# EAGLE schematic beltpack_v1_fixed (EAGLE 6.6.0)
Assembly variants: Cascade

## Sheet 1 of 5
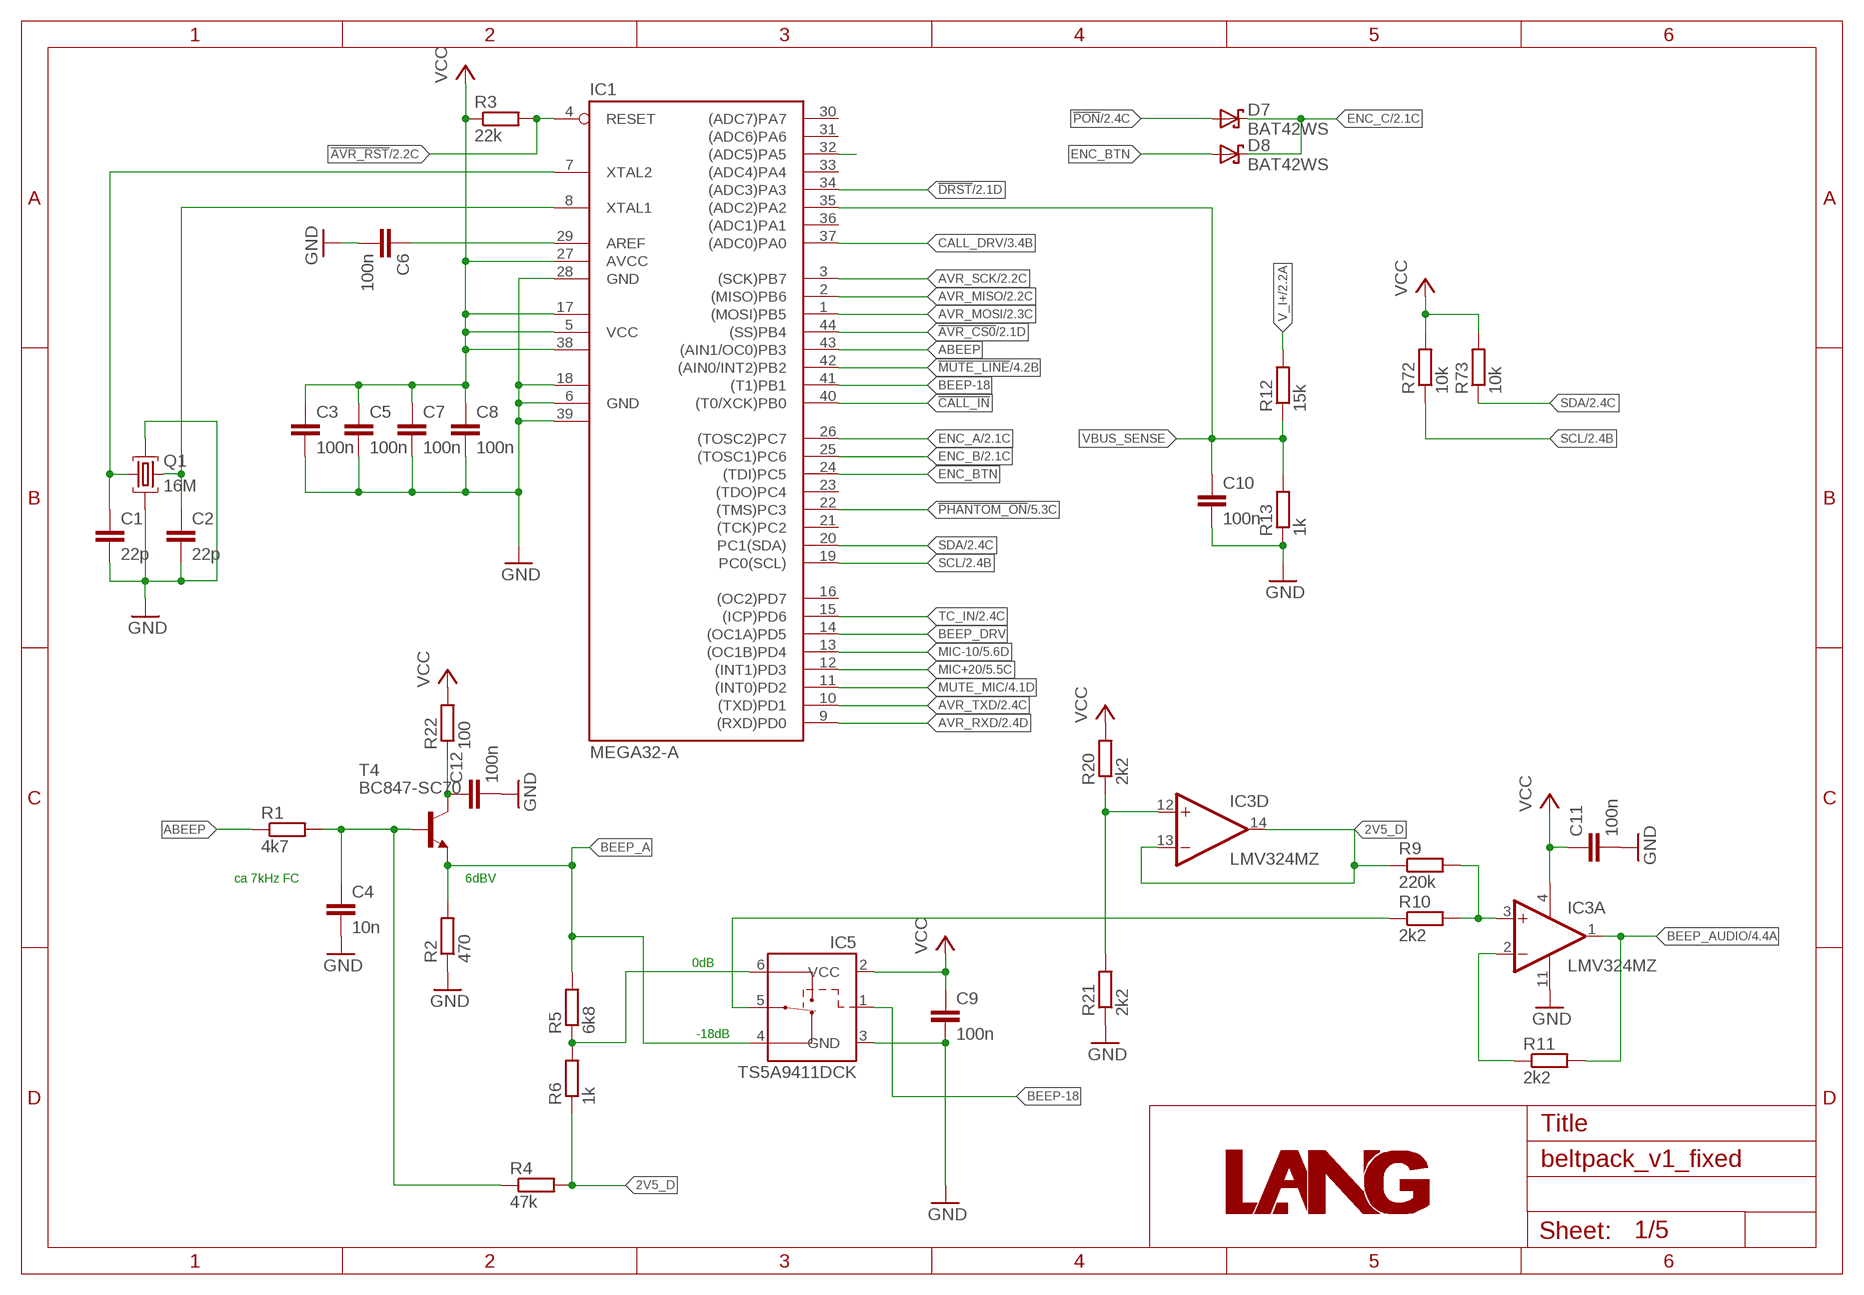
[diagram p0: schematic, sheet 1]
FRAME1 (A4L-LOC): PAGE_TITLE: Title

### Parts
C1  22p  C-EUC0603  [C0603]
C2  22p  C-EUC0603  [C0603]
C3  100n  C-EUC0603  [C0603]
C4  10n  C-EUC0603  [C0603]
C5  100n  C-EUC0603  [C0603]
C6  100n  C-EUC0603  [C0603]
C7  100n  C-EUC0603  [C0603]
C8  100n  C-EUC0603  [C0603]
C9  100n  C-EUC0603  [C0603]
C10  100n  C-EUC0603  [C0603]
C11  100n  C-EUC0603  [C0603]
C12  100n  C-EUC0603  [C0603]
D7  BAT42WS  [SOD323R_INFINEON]
D8  BAT42WS  [SOD323R_INFINEON]
IC1  MEGA32-A  [TQFP44]
IC3  LMV324MZ  [TSSOP14]
IC5  TS5A9411DCK  [SC70-6L]
Q1  16M  CRYSTAL_SHIELDEDMT  [MT]
R1  4k7  R-EU_R0603  [R0603]
R2  470  R-EU_R0603  [R0603]
R3  22k  R-EU_R0603  [R0603]
R4  47k  R-EU_R0603  [R0603]
R5  6k8  R-EU_R0603  [R0603]
R6  1k  R-EU_R0603  [R0603]
R9  220k  R-EU_R0603  [R0603]
R10  2k2  R-EU_R0603  [R0603]
R11  2k2  R-EU_R0603  [R0603]
R12  15k  R-EU_R0603  [R0603]
R13  1k  R-EU_R0603  [R0603]
R20  2k2  R-EU_R0603  [R0603]
R21  2k2  R-EU_R0603  [R0603]
R22  100  R-EU_R0603  [R0603]
R72  10k  R-EU_R0603  [R0603]
R73  10k  R-EU_R0603  [R0603]
T4  BC847-SC70  [SC70]

### Nets
2V5_D: IC3.13(D:-IN) IC3.14(D:OUT) R4.2 R6.1 R9.1
!AVR_CS0!: IC1.44((SS)PB4) ; also sheet 2
!AVR_RST!: IC1.4(RESET) R3.2 ; also sheet 2
!CALL_IN!: IC1.40((T0/XCK)PB0) ; also sheet 2
!DRST!: IC1.34((ADC3)PA3) ; also sheet 2
!MUTE_LINE!: IC1.42((AIN0/INT2)PB2) ; also sheet 4
!PHANTOM_ON!: IC1.22((TMS)PC3) ; also sheet 5
!PON!: D7.A ; also sheet 2
+5VA: C12.1 R22.1 T4.3(C)
ABEEP: IC1.43((AIN1/OC0)PB3) R1.1
AVR_MISO: IC1.2((MISO)PB6) ; also sheet 2
AVR_MOSI: IC1.1((MOSI)PB5) ; also sheet 2
AVR_RXD: IC1.9((RXD)PD0) ; also sheet 2
AVR_SCK: IC1.3((SCK)PB7) ; also sheet 2
AVR_TXD: IC1.10((TXD)PD1) ; also sheet 2
BEEP-18: IC1.41((T1)PB1) IC5.1(CTL)
BEEP_A: IC5.4(NC) R2.2 R5.2 T4.2(E)
BEEP_AUDIO: IC3.1(A:OUT) R11.2 ; also sheet 4
BEEP_DRV: IC1.14((OC1A)PD5)
CALL_DRV: IC1.37((ADC0)PA0) ; also sheet 3
ENC_A: IC1.26((TOSC2)PC7) ; also sheet 2
ENC_B: IC1.25((TOSC1)PC6) ; also sheet 2
ENC_BTN: D8.A IC1.24((TDI)PC5)
ENC_C: D7.C(K) D8.C(K) ; also sheet 2
GND: C1.2 C2.2 C3.2 C4.2 C5.2 C6.2 C7.2 C8.2 C9.2 C10.2 C11.2 C12.2 IC1.6(GND) IC1.18(GND1) IC1.28(GND) IC1.39(GND2) IC3.11(P:V-) IC5.3(GND) Q1.2(G1) Q1.4(G2) R2.1 R13.1 R21.1 ; also sheet 2,3,4,5
MIC+20: IC1.12((INT1)PD3) ; also sheet 5
MIC-10: IC1.13((OC1B)PD4) ; also sheet 5
MUTE_MIC: IC1.11((INT0)PD2) ; also sheet 4
N$17: C4.1 R1.2 R4.1 T4.1(B)
N$28: IC5.6(NO) R5.1 R6.2
N$39: IC3.12(D:+IN) R20.1 R21.2
N$52: IC3.3(A:+IN) R9.2 R10.2
N$53: IC3.2(A:-IN) R11.1
N$54: IC5.5(COM) R10.1
N$55: C6.1 IC1.29(AREF)
N$59: C1.1 IC1.7(XTAL2) Q1.1
N$60: C2.1 IC1.8(XTAL1) Q1.3
N$87: IC1.32((ADC5)PA5)
SCL: IC1.19(PC0(SCL)) R72.1 ; also sheet 2,4
SDA: IC1.20(PC1(SDA)) R73.1 ; also sheet 2,4
TC_IN: IC1.15((ICP)PD6) ; also sheet 2
V_I+: R12.2 ; also sheet 2
VBUS_SENSE: C10.1 IC1.35((ADC2)PA2) R12.1 R13.2
VCC: C3.1 C5.1 C7.1 C8.1 C9.1 C11.1 IC1.5(VCC) IC1.17(VCC1) IC1.27(AVCC) IC1.38(VCC2) IC3.4(P:V+) IC5.2(VCC) R3.1 R20.2 R22.2 R72.2 R73.2 ; also sheet 2,4,5
Unconnected: IC1.16((OC2)PD7) IC1.21((TCK)PC2) IC1.23((TDO)PC4) IC1.30((ADC7)PA7) IC1.31((ADC6)PA6) IC1.33((ADC4)PA4) IC1.36((ADC1)PA1)

### Notes on the sheet
- ca 7kHz FC | 6dBV
- 0dB
- -18dB

## Sheet 2 of 5
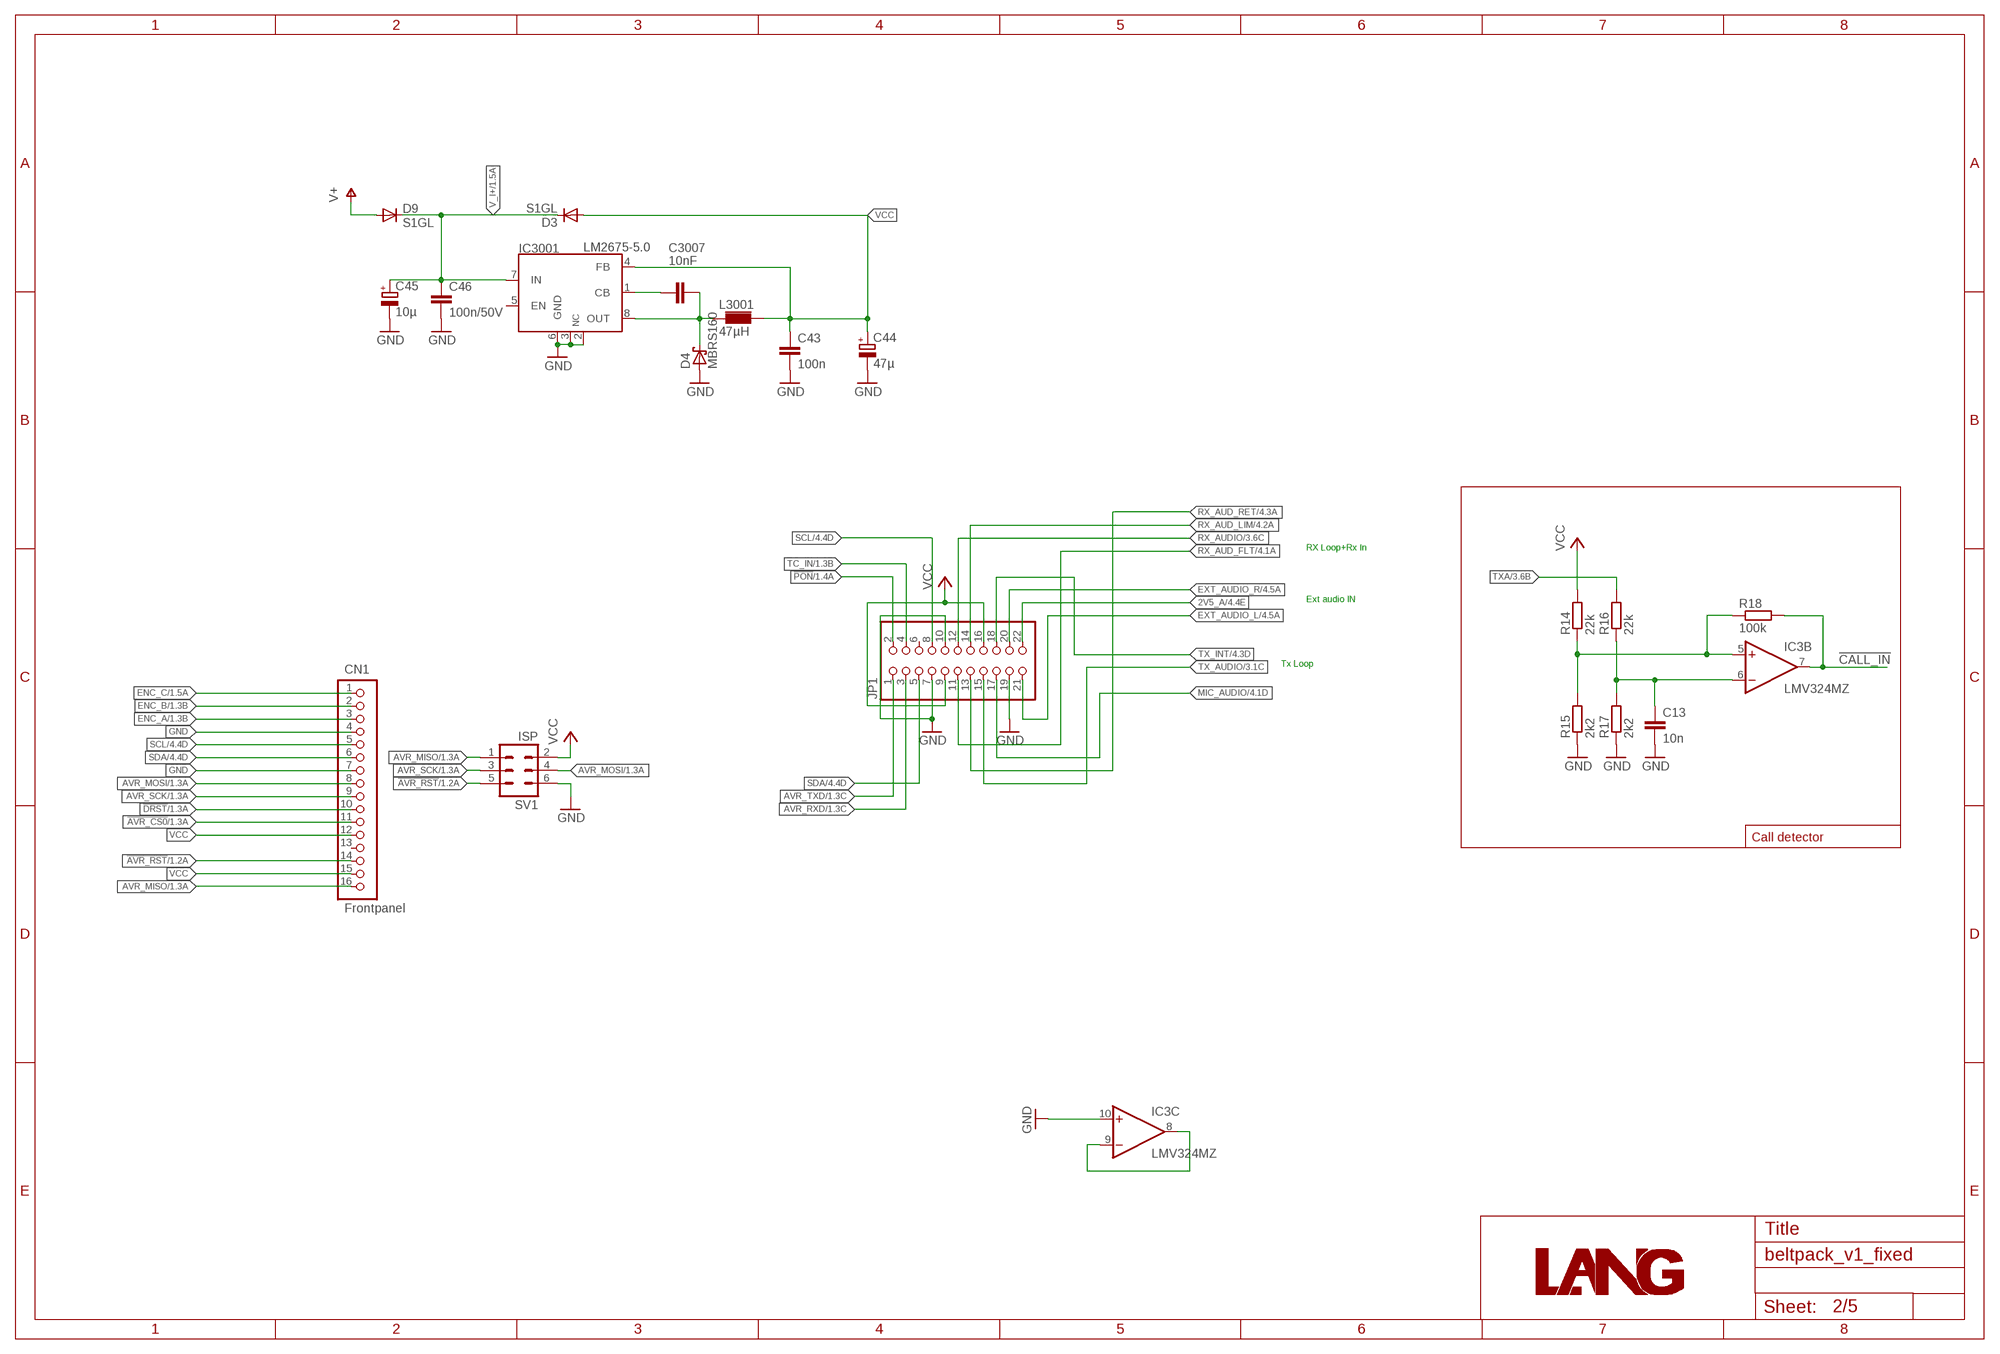
[diagram p1: schematic, sheet 2]
FRAME5 (A3L-LOC): PAGE_TITLE: Title

### Parts
C13  10n  C-EUC0603  [C0603]
C43  100n  C-EUC0603  [C0603]
C44  47µ  CPOL-EUB  [PANASONIC_B]
C45  10µ  CPOL-EUC  [PANASONIC_C]
C46  100n/50V  C-EUC0805  [C0805]
C3007  10nF  C-EUC0805  [C0805]
CN1  Frontpanel  MOLEX-505278-1633  [MOLEX-505278-1633]
D3  S1GL  DIODE-DO219AB  [DO219AB]
D4  MBRS160  SCHOTTKY-DIODESMD  [SMB]
D9  S1GL  DIODE-DO219AB  [DO219AB]
IC3001  LM2675-5.0  LM2676_SOIC  [SO-08]
JP1  PINHD-2X11  [2X11]
L3001  47µH  L-PISM  [PISM]
R14  22k  R-EU_R0603  [R0603]
R15  2k2  R-EU_R0603  [R0603]
R16  22k  R-EU_R0603  [R0603]
R17  2k2  R-EU_R0603  [R0603]
R18  100k  R-EU_R0603  [R0603]
SV1  ISP  ML6  [ML6]

### Nets
2V5_A: JP1.22 ; also sheet 4,5
!AVR_CS0!: CN1.11 ; also sheet 1
!AVR_RST!: CN1.14 SV1.5 ; also sheet 1
!CALL_IN!: IC3.7(B:OUT) R18.2 ; also sheet 1
!DRST!: CN1.10 ; also sheet 1
!PON!: JP1.2 ; also sheet 1
AVR_MISO: CN1.16 SV1.1 ; also sheet 1
AVR_MOSI: CN1.8 SV1.4 ; also sheet 1
AVR_RXD: JP1.3 ; also sheet 1
AVR_SCK: CN1.9 SV1.3 ; also sheet 1
AVR_TXD: JP1.1 ; also sheet 1
ENC_A: CN1.3 ; also sheet 1
ENC_B: CN1.2 ; also sheet 1
ENC_C: CN1.1 ; also sheet 1
EXT_AUDIO_L: JP1.21 ; also sheet 4
EXT_AUDIO_R: JP1.20 ; also sheet 4
GND: C13.2 C43.2 C44.- C45.- C46.2 CN1.4 CN1.7 D4.A IC3.10(C:+IN) IC3001.2(NC) IC3001.3(NC) IC3001.6(GND) JP1.7 JP1.10 JP1.19 R15.1 R17.1 SV1.6 ; also sheet 1,3,4,5
MIC_AUDIO: JP1.17 ; also sheet 4,5
N$27: C3007.2 D4.C IC3001.8(OUT) L3001.P$1
N$29: C3007.1 IC3001.1(CB)
N$41: IC3.8(C:OUT) IC3.9(C:-IN)
N$50: C13.1 IC3.6(B:-IN) R16.1 R17.2
N$51: IC3.5(B:+IN) R14.1 R15.2 R18.1
RX_AUD_FLT: JP1.11 ; also sheet 4
RX_AUD_LIM: JP1.14 ; also sheet 4
RX_AUD_RET: JP1.13 ; also sheet 4
RX_AUDIO: JP1.12 ; also sheet 3,4
SCL: CN1.5 JP1.8 ; also sheet 1,4
SDA: CN1.6 JP1.5 ; also sheet 1,4
TC_IN: JP1.4 ; also sheet 1
TX_AUDIO: JP1.15 ; also sheet 3,4
TX_INT: JP1.18 ; also sheet 4
TXA: R16.2 ; also sheet 3
V+: D9.A ; also sheet 3
V_I+: C45.+ C46.1 D3.C D9.C IC3001.7(IN) ; also sheet 1
VCC: C43.1 C44.+ CN1.12 CN1.15 D3.A IC3001.4(FB) JP1.9 JP1.16 L3001.P$2 R14.2 SV1.2 ; also sheet 1,4,5
Unconnected: CN1.13 IC3001.5(EN) JP1.6

### Notes on the sheet
- RX Loop+Rx In
- Ext audio IN
- Tx Loop
- Call detector

## Sheet 3 of 5
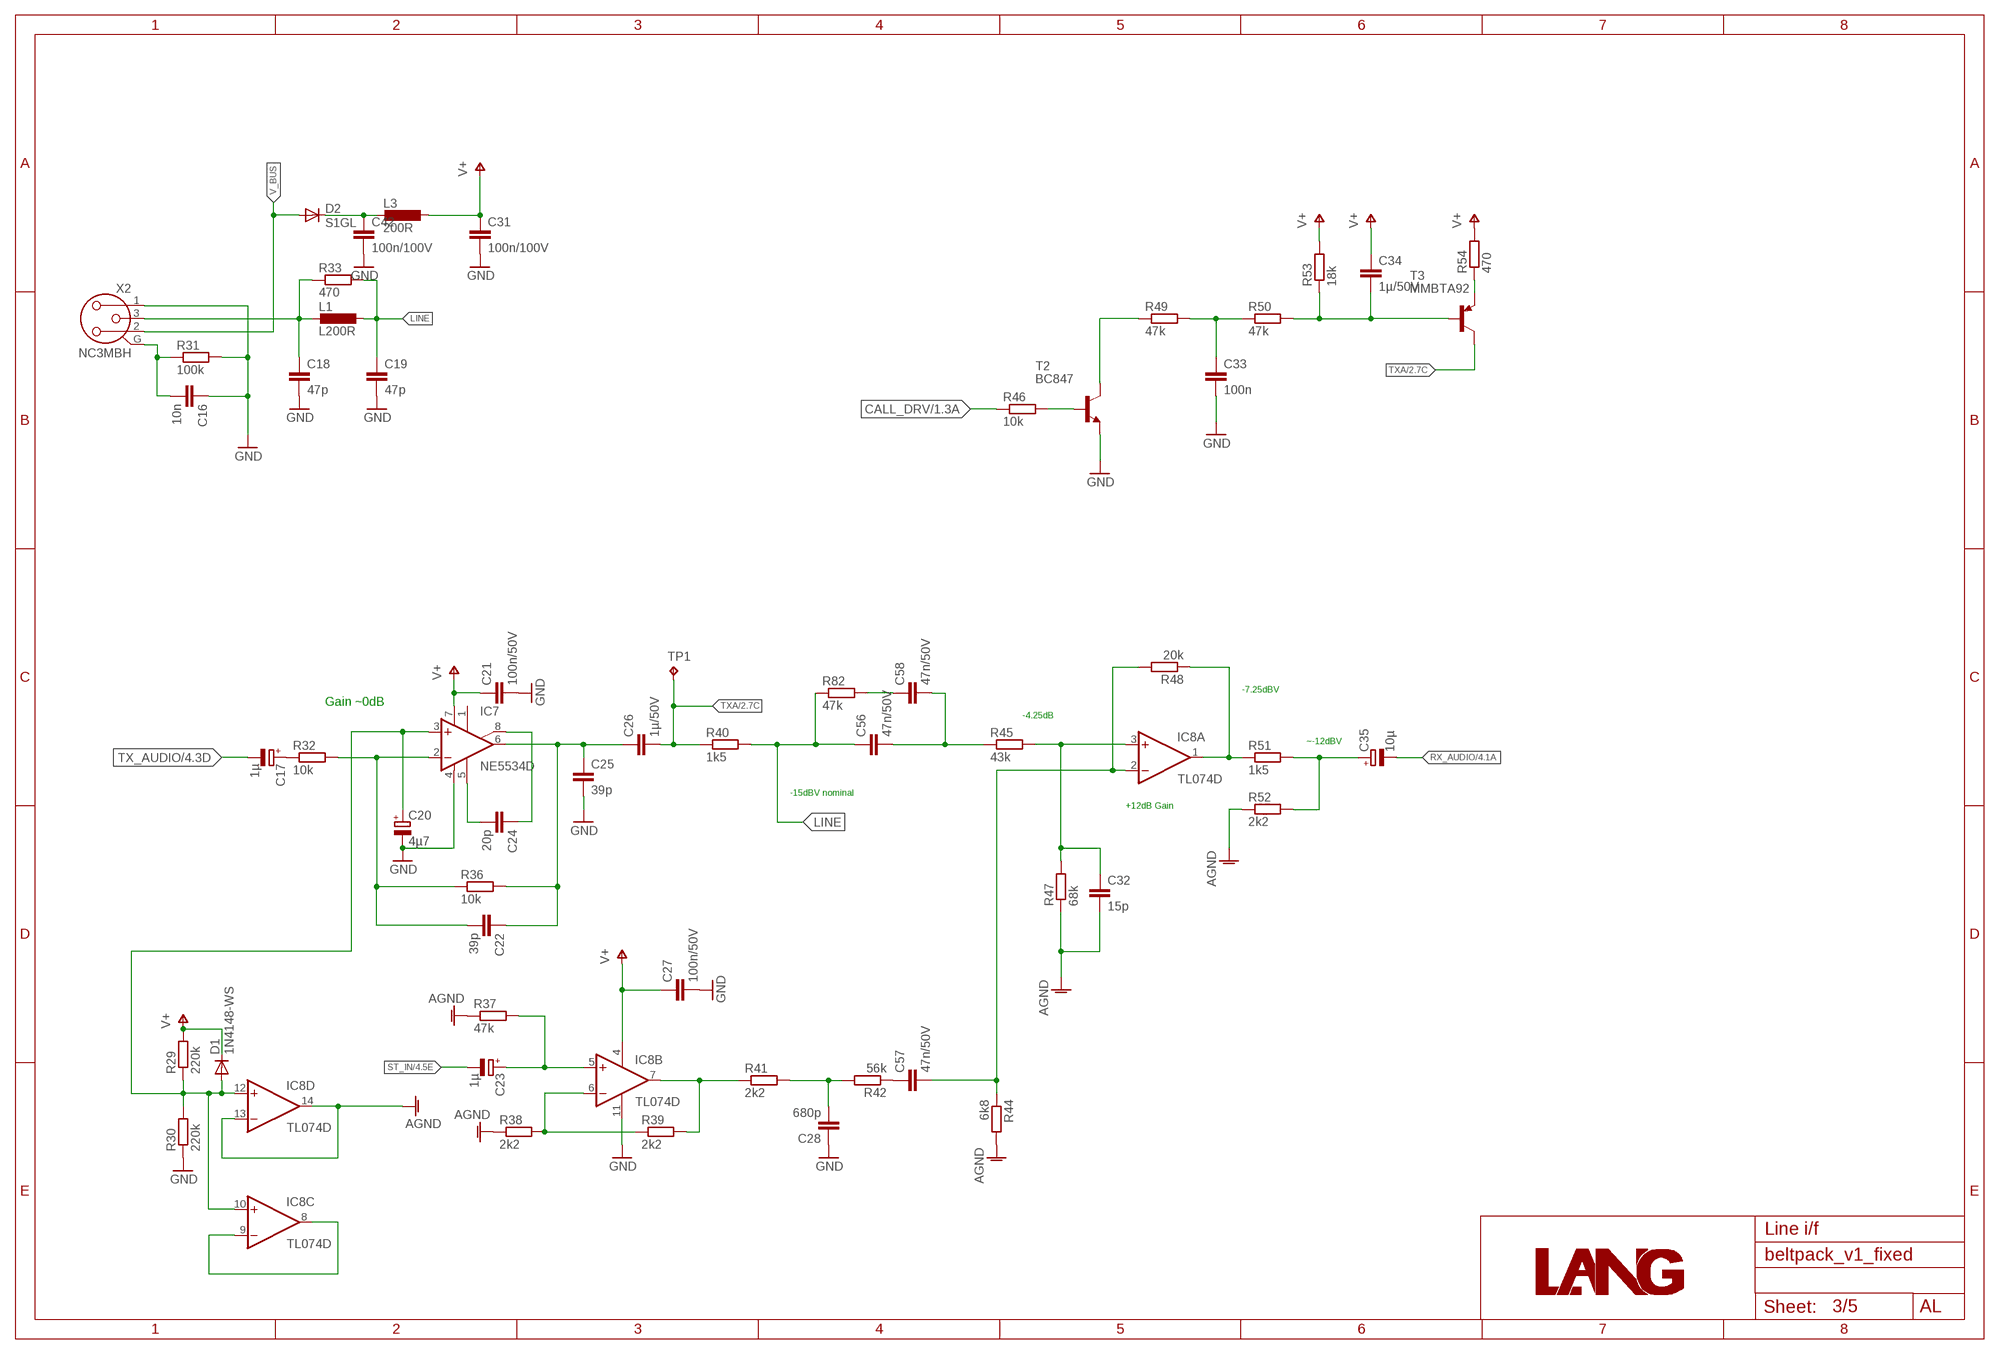
[diagram p2: schematic, sheet 3]
FRAME2 (A3L-LOC): EDITOR_INITIALS: AL; PAGE_TITLE: Line i/f

### Parts
C16  10n  C-EUC0805  [C0805]
C17  1µ  CPOL-EUB  [PANASONIC_B]
C18  47p  C-EUC0603  [C0603]
C19  47p  C-EUC0603  [C0603]
C20  4µ7  CPOL-EUB  [PANASONIC_B]
C21  100n/50V  C-EUC0805  [C0805]
C22  39p  C-EUC0603  [C0603]
C23  1µ  CPOL-EUB  [PANASONIC_B]
C24  20p  C-EUC0603  [C0603]
C25  39p  C-EUC0603  [C0603]
C26  1µ/50V  C-EUC1206  [C1206]
C27  100n/50V  C-EUC0805  [C0805]
C28  680p  C-EUC0603  [C0603]
C31  100n/100V  C-EUC1206  [C1206]
C32  15p  C-EUC0603  [C0603]
C33  100n  C-EUC0603  [C0603]
C34  1µ/50V  C-EUC1206  [C1206]
C35  10µ  CPOL-EUB  [PANASONIC_B]
C42  100n/100V  C-EUC1206  [C1206]
C56  47n/50V  C-EUPAN_E1  [C_PAN_ECHU_E1]
C57  47n/50V  C-EUPAN_E1  [C_PAN_ECHU_E1]
C58  47n/50V  C-EUPAN_E1  [C_PAN_ECHU_E1]
D1  1N4148-WS  [SOD323]
D2  S1GL  DIODE-DO219AB  [DO219AB]
IC7  NE5534D  [SO08]
IC8  TL074D  [SO14]
L1  L200R  L-EU_L0805  [R0805]
L3  200R  L-EU_L0805  [R0805]
R29  220k  R-EU_R0603  [R0603]
R30  220k  R-EU_R0603  [R0603]
R31  100k  R-EU_R0805  [R0805]
R32  10k  R-EU_R0603  [R0603]
R33  470  R-EU_R0603  [R0603]
R36  10k  R-EU_R0603  [R0603]
R37  47k  R-EU_R0603  [R0603]
R38  2k2  R-EU_R0603  [R0603]
R39  2k2  R-EU_R0603  [R0603]
R40  1k5  R-EU_R1206  [R1206]
R41  2k2  R-EU_R0603  [R0603]
R42  56k  R-EU_R0603  [R0603]
R44  6k8  R-EU_R0603  [R0603]
R45  43k  R-EU_R0603  [R0603]
R46  10k  R-EU_R0603  [R0603]
R47  68k  R-EU_R0603  [R0603]
R48  20k  R-EU_R0603  [R0603]
R49  47k  R-EU_R0603  [R0603]
R50  47k  R-EU_R0603  [R0603]
R51  1k5  R-EU_R0603  [R0603]
R52  2k2  R-EU_R0603  [R0603]
R53  18k  R-EU_R0603  [R0603]
R54  470  R-EU_R0805  [R0805]
R82  47k  R-EU_R0603  [R0603]
T2  BC847  [SOT23]
T3  MMBTA92  [SOT23]
TP1  XA  TPB1,27  [B1,27]
X2  NC3MBH  [NC3MBH]

### Nets
AGND: C32.2 IC8.13(D:-IN) IC8.14(D:OUT) R37.1 R38.1 R44.2 R47.1 R52.1
CALL_DRV: R46.1 ; also sheet 1
GND: C16.1 C18.2 C19.2 C20.- C21.2 C25.2 C27.2 C28.1 C31.2 C33.2 C42.2 IC7.4(V-) IC8.11(P:V-) R30.1 R31.2 T2.2(E) X2.1 ; also sheet 1,2,4,5
LINE: C19.1 C56.1 L1.1 R33.2 R40.2 R82.1
N$1: C24.2 IC7.5(CMP)
N$2: C24.1 IC7.8(ON/CMP)
N$3: C22.2 IC7.2(-IN) R32.2 R36.1
N$4: C17.+ R32.1
N$5: C22.1 C25.1 C26.1 IC7.6(OUT) R36.2
N$6: C20.+ D1.A IC7.3(+IN) IC8.10(C:+IN) IC8.12(D:+IN) R29.1 R30.2
N$7: R46.2 T2.1(B)
N$8: C16.2 R31.1 X2.G
N$10: C58.1 R82.2
N$11: C28.2 R41.2 R42.2
N$12: C32.1 IC8.3(A:+IN) R45.2 R47.2
N$13: C18.1 L1.2 R33.1 X2.3
N$14: C35.+ R51.2 R52.2
N$15: C57.2 IC8.2(A:-IN) R44.1 R48.2
N$16: C57.1 R42.1
N$26: C42.1 D2.C L3.2
N$31: C56.2 C58.2 R45.1
N$32: R54.1 T3.2(E)
N$33: C34.2 R50.2 R53.1 T3.1(B)
N$34: C33.1 R49.2 R50.1
N$37: R49.1 T2.3(C)
N$42: IC8.1(A:OUT) R48.1 R51.1
N$66: IC8.7(B:OUT) R39.2 R41.1
N$70: IC8.6(B:-IN) R38.2 R39.1
N$76: C23.+ IC8.5(B:+IN) R37.2
N$77: IC8.8(C:OUT) IC8.9(C:-IN)
RX_AUDIO: C35.- ; also sheet 2,4
ST_IN: C23.- ; also sheet 4
TX_AUDIO: C17.- ; also sheet 2,4
TXA: C26.2 R40.1 T3.3(C) TP1.TP ; also sheet 2
V+: C21.1 C27.1 C31.1 C34.1 D1.K(C) IC7.7(V+) IC8.4(P:V+) L3.1 R29.2 R53.2 R54.2 ; also sheet 2
V_BUS: D2.A X2.2
Unconnected: IC7.1(ON)

### Notes on the sheet
- -7.25dBV
- Gain ~0dB
- -4.25dB
- ~-12dBV
- -15dBV nominal
- +12dB Gain

## Sheet 4 of 5
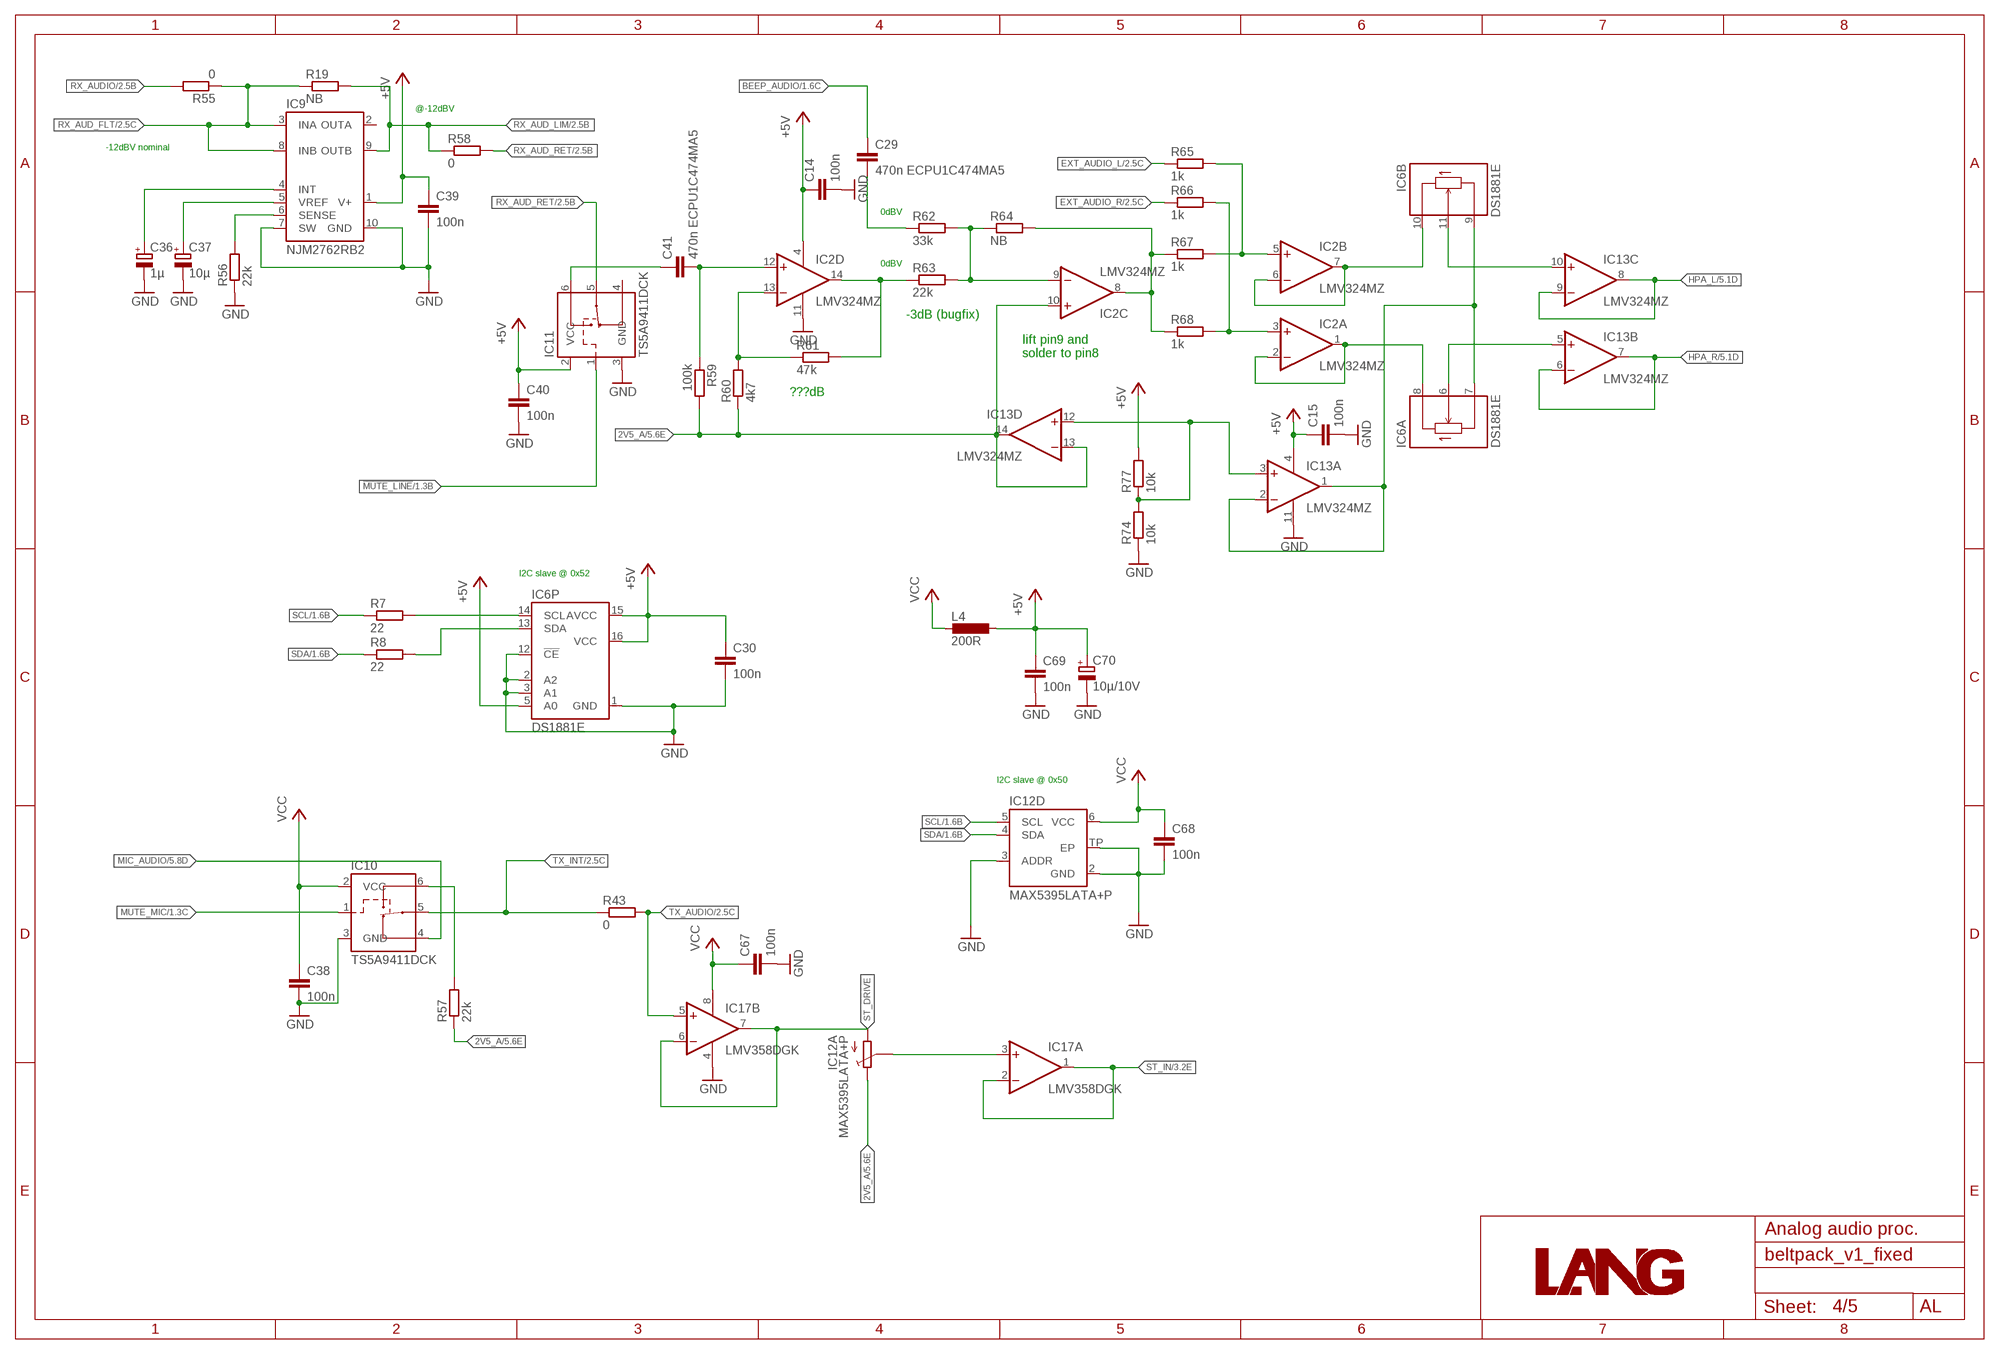
[diagram p3: schematic, sheet 4]
FRAME3 (A3L-LOC): EDITOR_INITIALS: AL; PAGE_TITLE: Analog audio proc.

### Parts
C14  100n  C-EUC0603  [C0603]
C15  100n  C-EUC0603  [C0603]
C29  470n ECPU1C474MA5  C-EUPAN_H3  [C_PANASONIC_H3]
C30  100n  C-EUC0603  [C0603]
C36  1µ  CPOL-EUB  [PANASONIC_B]
C37  10µ  CPOL-EUB  [PANASONIC_B]
C38  100n  C-EUC0402  [C0402]
C39  100n  C-EUC0603  [C0603]
C40  100n  C-EUC0603  [C0603]
C41  470n ECPU1C474MA5  C-EUPAN_H3  [C_PANASONIC_H3]
C67  100n  C-EUC0603  [C0603]
C68  100n  C-EUC0603  [C0603]
C69  100n  C-EUC0603  [C0603]
C70  10µ/10V  CPOL-EUA/3216-18R  [A/3216-18R]
IC2  LMV324MZ  [TSSOP14]
IC6  DS1881E  [TSSOP16]
IC9  NJM2762RB2  [MSOP10]
IC10  TS5A9411DCK  [SC70-6L]
IC11  TS5A9411DCK  [SC70-6L]
IC12  MAX5395LATA+P  [8TDFN-EP]
IC13  LMV324MZ  [TSSOP14]
IC17  LMV358DGK  [VSOP8]
L4  200R  L-EU_L0805  [R0805]
R7  22  R-EU_R0402  [R0402]
R8  22  R-EU_R0402  [R0402]
R19  NB  R-EU_R0603  [R0603]
R43  0  R-EU_R0603  [R0603]
R55  0  R-EU_R0603  [R0603]
R56  22k  R-EU_R0603  [R0603]
R57  22k  R-EU_R0603  [R0603]
R58  0  R-EU_R0603  [R0603]
R59  100k  R-EU_R0603  [R0603]
R60  4k7  R-EU_R0603  [R0603]
R61  47k  R-EU_R0603  [R0603]
R62  33k  R-EU_R0603  [R0603]
R63  22k  R-EU_R0603  [R0603]
R64  NB  R-EU_R0603  [R0603]
R65  1k  R-EU_R0603  [R0603]
R66  1k  R-EU_R0603  [R0603]
R67  1k  R-EU_R0603  [R0603]
R68  1k  R-EU_R0603  [R0603]
R74  10k  R-EU_R0603  [R0603]
R77  10k  R-EU_R0603  [R0603]

### Nets
2V5_A: IC2.10(C:+IN) IC12.8(A:E) IC13.13(D:-IN) IC13.14(D:OUT) R57.1 R59.2 R60.1 ; also sheet 2,5
!MUTE_LINE!: IC11.1(CTL) ; also sheet 1
+5V: C14.1 C15.1 C30.1 C39.1 C40.1 C69.1 C70.+ IC2.4(P:V+) IC6.5(P:A0) IC6.15(P:AVCC) IC6.16(P:VCC) IC9.1(V+) IC11.2(VCC) IC13.4(P:V+) L4.1 R77.2
BEEP_AUDIO: C29.1 ; also sheet 1
EXT_AUDIO_L: R65.1 ; also sheet 2
EXT_AUDIO_R: R66.1 ; also sheet 2
GND: C14.2 C15.2 C30.2 C36.- C37.- C38.2 C39.2 C40.2 C67.2 C68.2 C69.2 C70.- IC2.11(P:V-) IC6.1(P:GND) IC6.2(P:A2) IC6.3(P:A1) IC6.12(P:!CE!) IC9.7(SW) IC9.10(GND) IC10.3(GND) IC11.3(GND) IC12.2(D:GND) IC12.3(D:ADDR) IC12.TP(D:EP) IC13.11(P:V-) IC17.4(P:V-) R56.1 R74.1 ; also sheet 1,2,3,5
HPA_L: IC13.8(C:OUT) IC13.9(C:-IN) ; also sheet 5
HPA_R: IC13.6(B:-IN) IC13.7(B:OUT) ; also sheet 5
MIC_AUDIO: IC10.4(NC) ; also sheet 2,5
MIX_L: IC2.6(B:-IN) IC2.7(B:OUT) IC6.10(B:H)
MIX_R: IC2.1(A:OUT) IC2.2(A:-IN) IC6.8(A:H)
MUTE_MIC: IC10.1(CTL) ; also sheet 1
N$9: IC6.11(B:W) IC13.10(C:+IN)
N$18: IC6.6(A:W) IC13.5(B:+IN)
N$19: IC6.14(P:SCL) R7.2
N$20: IC6.13(P:SDA) R8.2
N$21: IC6.7(A:L) IC6.9(B:L) IC13.1(A:OUT) IC13.2(A:-IN)
N$22: IC13.3(A:+IN) IC13.12(D:+IN) R74.2 R77.1
N$25: C29.2 R62.1
N$43: C41.1 IC11.6(NO)
N$49: IC2.13(D:-IN) R60.2 R61.1
N$67: C36.+ IC9.4(INT)
N$68: C37.+ IC9.5(VREF)
N$69: IC2.14(D:OUT) R61.2 R63.1
N$71: IC9.6(SENSE) R56.2
N$72: C41.2 IC2.12(D:+IN) R59.1
N$73: IC2.9(C:-IN) R62.2 R63.2 R64.1
N$75: IC2.8(C:OUT) R64.2 R67.1 R68.1
N$78: IC2.5(B:+IN) R65.2 R67.2
N$79: IC2.3(A:+IN) R66.2 R68.2
N$80: IC10.6(NO) R57.2
N$85: IC12.7(A:S) IC17.3(A:+IN)
RX_AUD_FLT: IC9.3(INA) IC9.8(INB) R19.1 R55.1 ; also sheet 2
RX_AUD_LIM: IC9.9(OUTB) R19.2 R58.1 ; also sheet 2
RX_AUD_RET: IC11.5(COM) R58.2 ; also sheet 2
RX_AUDIO: R55.2 ; also sheet 2,3
SCL: IC12.5(D:SCL) R7.1 ; also sheet 1,2
SDA: IC12.4(D:SDA) R8.1 ; also sheet 1,2
ST_DRIVE: IC12.1(A:A) IC17.6(B:-IN) IC17.7(B:OUT)
ST_IN: IC17.1(A:OUT) IC17.2(A:-IN) ; also sheet 3
TX_AUDIO: IC17.5(B:+IN) R43.2 ; also sheet 2,3
TX_INT: IC10.5(COM) R43.1 ; also sheet 2
VCC: C38.1 C67.1 C68.1 IC10.2(VCC) IC12.6(D:VCC) IC17.8(P:V+) L4.2 ; also sheet 1,2,5
Unconnected: IC9.2(OUTA) IC11.4(NC)

### Notes on the sheet
- @-12dBV
- -12dBV nominal
- 0dBV
- 0dBV
- -3dB (bugfix)
- lift pin9 and 
  solder to pin8
- ???dB
- I2C slave @ 0x52
- I2C slave @ 0x50

## Sheet 5 of 5
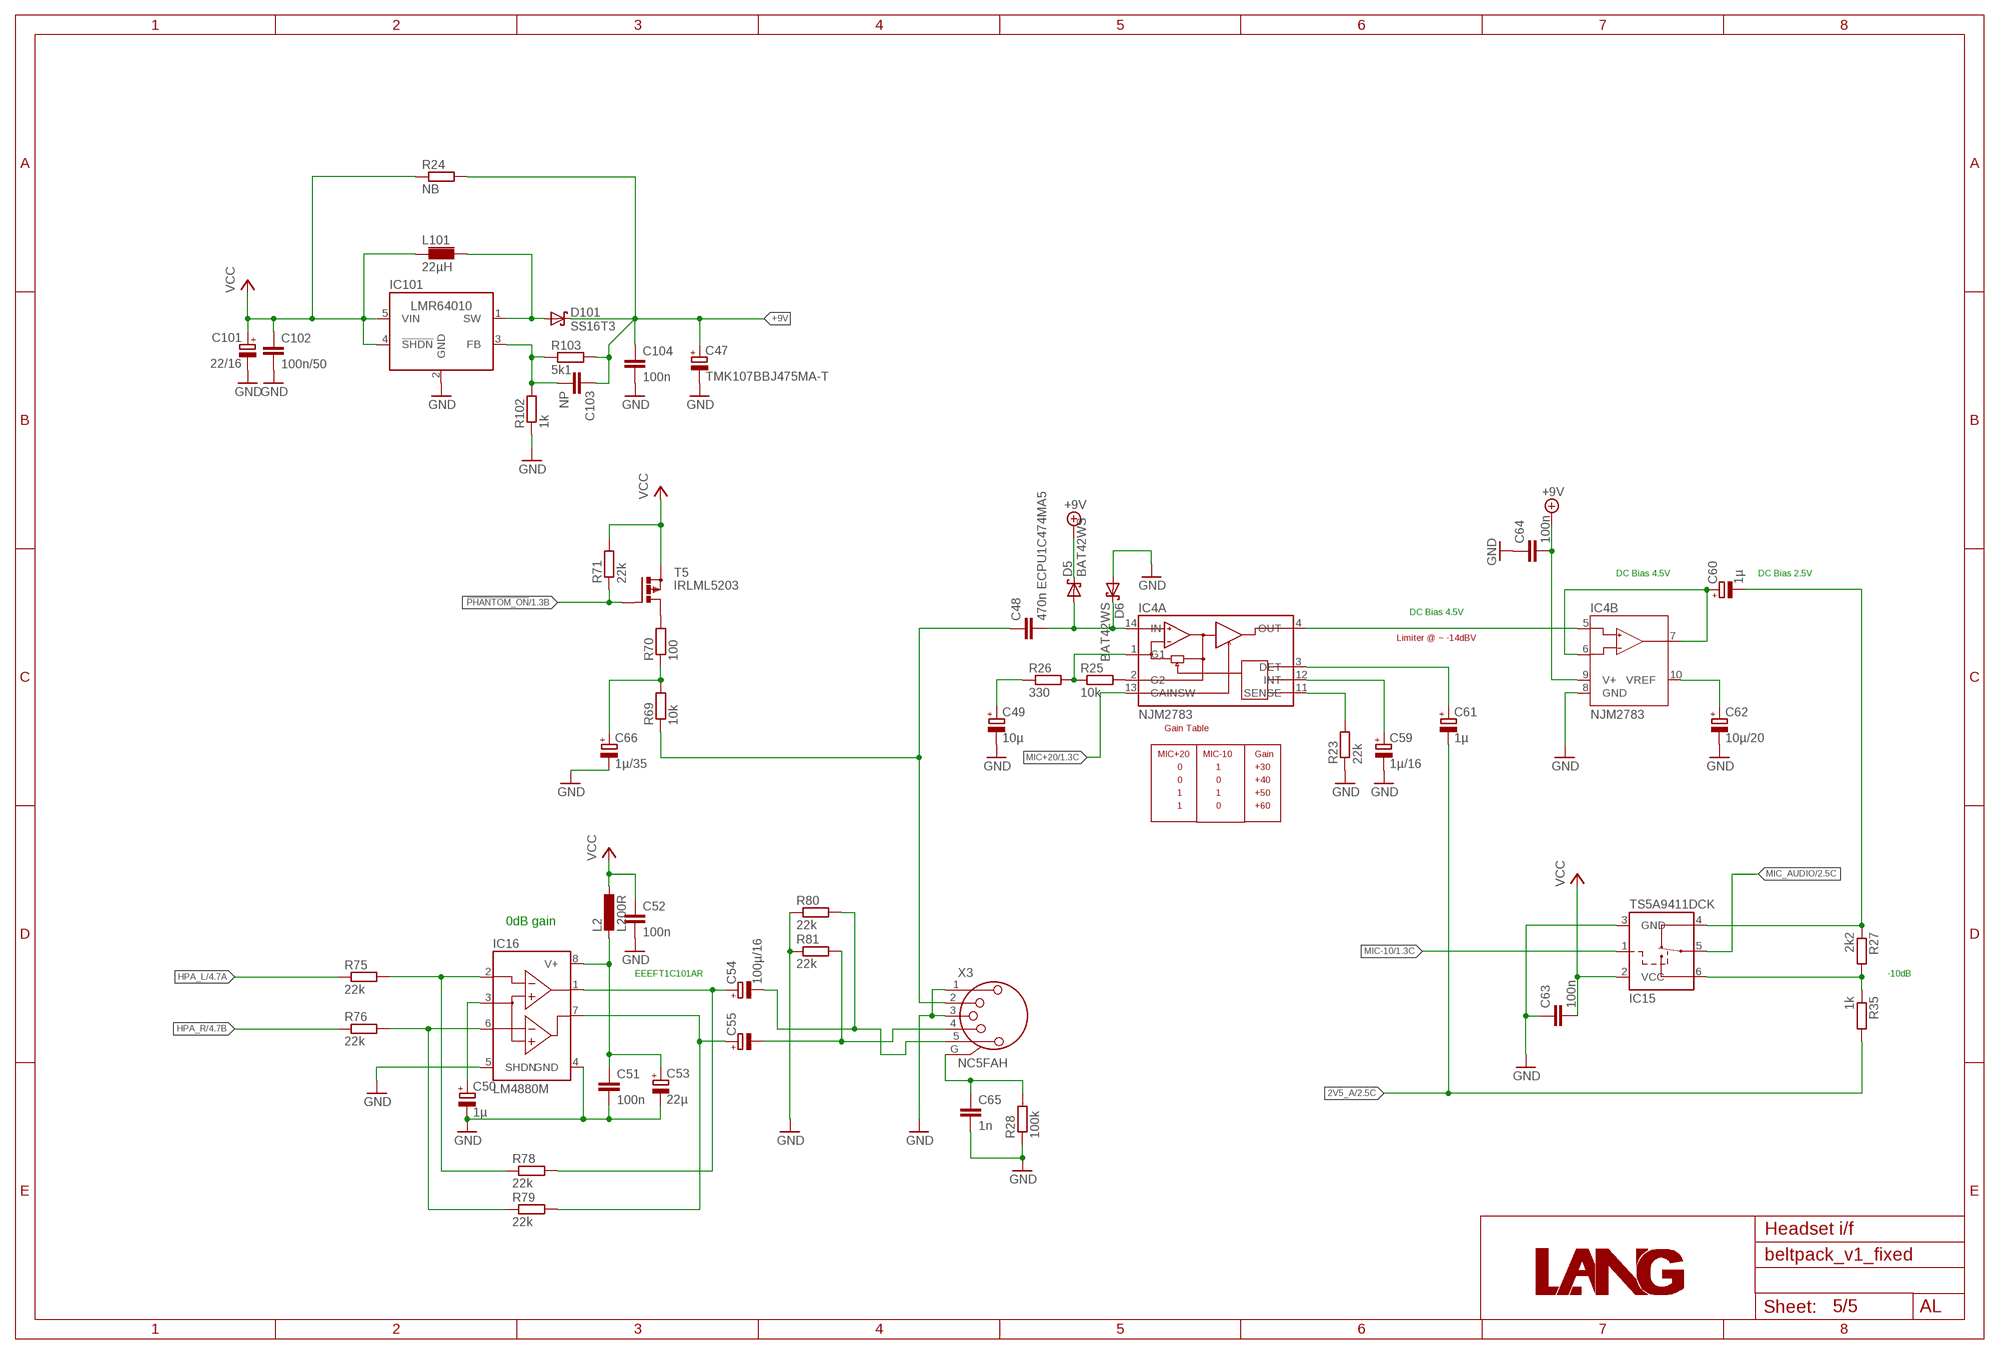
[diagram p4: schematic, sheet 5]
FRAME4 (A3L-LOC): EDITOR_INITIALS: AL; PAGE_TITLE: Headset i/f

### Parts
C47  TMK107BBJ475MA-T  CPOL-EUB  [PANASONIC_B]
C48  470n ECPU1C474MA5  C-EUPAN_H3  [C_PANASONIC_H3]
C49  10µ  CPOL-EUB  [PANASONIC_B]
C50  1µ  CPOL-EUB  [PANASONIC_B]
C51  100n  C-EUC0603  [C0603]
C52  100n  C-EUC0603  [C0603]
C53  22µ  CPOL-EUC  [PANASONIC_C]
C54  100µ/16  CPOL-EUC  [PANASONIC_C]
C55  100µ/16  CPOL-EUC  [PANASONIC_C]
C59  1µ/16  CPOL-EUA/3216-18R  [A/3216-18R]
C60  1µ  CPOL-EUB  [PANASONIC_B]
C61  1µ  CPOL-EUB  [PANASONIC_B]
C62  10µ/20  CPOL-EUB/3528-21R  [B/3528-21R]
C63  100n  C-EUC0402  [C0402]
C64  100n  C-EUC0603  [C0603]
C65  1n  C-EUC0603  [C0603]
C66  1µ/35  CPOL-EUB/3528-21R  [B/3528-21R]
C101  22/16  CPOL-EUB/3528-21R  [B/3528-21R]  (not fitted in variant Cascade)
C102  100n/50  C-EUC0805  [C0805]  (not fitted in variant Cascade)
C103  NP  C-EUC0603  [C0603]  (not fitted in variant Cascade)
C104  100n  C-EUC0603  [C0603]  (not fitted in variant Cascade)
D5  BAT42WS  [SOD323R_INFINEON]
D6  BAT42WS  [SOD323R_INFINEON]
D101  SS16T3  [SMA]  (not fitted in variant Cascade)
IC4  NJM2783  [TSSOP14]
IC15  TS5A9411DCK  [SC70-6L]
IC16  LM4880M  [SOIC8]
IC101  LMR64010  [SOT23-5]  (not fitted in variant Cascade)
L2  L200R  L-EU_L0805  [R0805]
L101  22µH  L-PISG  [PISG]  (not fitted in variant Cascade)
R23  22k  R-EU_R0603  [R0603]
R24  NB  R-EU_R0603  [R0603]
R25  10k  R-EU_R0603  [R0603]
R26  330  R-EU_R0603  [R0603]
R27  2k2  R-EU_R0603  [R0603]
R28  100k  R-EU_R0603  [R0603]
R35  1k  R-EU_R0603  [R0603]
R69  10k  R-EU_R0603  [R0603]
R70  100  R-EU_R0603  [R0603]
R71  22k  R-EU_R0603  [R0603]
R75  22k  R-EU_R0603  [R0603]
R76  22k  R-EU_R0603  [R0603]
R78  22k  R-EU_R0603  [R0603]
R79  22k  R-EU_R0603  [R0603]
R80  22k  R-EU_R0603  [R0603]
R81  22k  R-EU_R0603  [R0603]
R102  1k  R-EU_R0603  [R0603]  (not fitted in variant Cascade)
R103  5k1  R-EU_R0603  [R0603]  (not fitted in variant Cascade)
T5  IRLML5203  [SOT23]
X3  NC5FAH  [NC5FAH]

### Nets
2V5_A: C61.- R35.2 ; also sheet 2,4
!PHANTOM_ON!: R71.1 T5.1(G) ; also sheet 1
+9V: C47.+ C64.2 C103.1 C104.1 D5.C(K) D101.C(K) IC4.9(B:V+) R24.2 R103.2
GND: C47.- C49.- C50.- C51.2 C52.2 C53.- C59.- C62.- C63.1 C64.1 C65.2 C66.- C101.- C102.2 C104.2 D6.A IC4.8(B:GND) IC15.3(GND) IC16.4(GND) IC16.5(SHDN) IC101.2(GND) R23.1 R28.1 R80.1 R81.1 R102.1 X3.1 X3.3 ; also sheet 1,2,3,4
HPA_L: R75.1 ; also sheet 4
HPA_R: R76.1 ; also sheet 4
MIC: C48.1 R69.1 X3.2
MIC+20: IC4.13(A:GAINSW) ; also sheet 1
MIC-10: IC15.1(CTL) ; also sheet 1
MIC_AUDIO: IC15.5(COM) ; also sheet 2,4
N$23: C54.+ IC16.1(OUTA) R78.2
N$24: C55.+ IC16.7(OUTB) R79.2
N$30: C103.2 IC101.3(FB) R102.2 R103.1
N$35: C55.- R81.2 X3.4
N$36: C54.- R80.2 X3.5
N$38: C50.+ IC16.3(BYPASS)
N$40: C48.2 D5.A D6.C(K) IC4.14(A:IN)
N$44: IC4.2(A:G2) R25.2
N$45: IC4.1(A:G1) R25.1 R26.2
N$46: C49.+ R26.1
N$47: C59.+ IC4.12(A:INT)
N$48: C65.1 R28.2 X3.G
N$56: C51.1 C53.+ IC16.8(V+) L2.2
N$57: C61.+ IC4.3(A:DET)
N$58: IC4.4(A:OUT) IC4.5(B:BUFIN)
N$61: IC4.11(A:SENSE) R23.2
N$62: C60.+ IC4.6(B:BUFG) IC4.7(B:BUFO)
N$63: IC15.6(NO) R27.2 R35.1
N$64: C66.+ R69.2 R70.1
N$65: C60.- IC15.4(NC) R27.1
N$82: C62.+ IC4.10(B:VREF)
N$83: R70.2 T5.3(D)
N$6434: IC16.6(INB) R76.2 R79.1
N$19213: IC16.2(INA) R75.2 R78.1
SW_HV: D101.A IC101.1(SW) L101.P$2
VCC: C52.1 C63.2 C101.+ C102.1 IC15.2(VCC) IC101.4(!SHDN!) IC101.5(VIN) L2.1 L101.P$1 R24.1 R71.2 T5.2(S) ; also sheet 1,2,4

### Notes on the sheet
- DC Bias 4.5V | DC Bias 2.5V
- DC Bias 4.5V
- Limiter @ ~ -14dBV
- Gain Table
- MIC+20 | MIC-10 | Gain
- 0 | 1 | +30
- 0 | 0 | +40
- 1 | 1 | +50
- 1 | 0 | +60
- 0dB gain
- EEEFT1C101AR | -10dB

## Library data of the parts
C1-C16 C18 C19 C21 C22 C24-C28 C30-C34 C38-C40 C42 C43 C46 C51 C52 C63-C65 C67-C69 C102-C104 C3007 = rcl:C-EU: CAPACITOR, European symbol
C17 C20 C23 C35-C37 C44 C45 C47 C49 C50 C53-C55 C59-C62 C66 C70 C101 = rcl:CPOL-EU: POLARIZED CAPACITOR, European symbol
C29 C41 C48 C56-C58 = mylcr:C-EU
CN1 = mycon:MOLEX-505278-1633
D1 = dioden:1N4148: DIODE high speed (Philips)
D2 D3 D9 = dioden:DIODE
D4 = diode:SCHOTTKY-DIODE: Schottky Diode
D5-D8 = dioden:BAT4: SURFACE MOUNT SCHOTTKY BARRIER DIODE Repetitive Reverse Voltage VRRM 30V Continuous Forwar Current IFM 200mA Repetitive Peak Current IPK 500mA
D101 = dioden:SS16T3
IC1 = atmel:MEGA32: MICROCONTROLLER 32 Kbytes FLASH 2 Kbytes SRAM 1 Kbytes EEPROM USART 8-channel 10 bit ADC Source: www.atmel.com .. doc2503.pdf
IC2 IC3 IC13 = linear:LMV324?*: Quad General Purpose, Low Voltage, Rail-to-Rail Output Operational Amplifiers Source: http://www.national.com/mpf/LM/LMV321.html http://www.national.com/dt/lmv_qual.pdf
IC4 = njr:NJM2783
IC5 IC10 IC11 IC15 = myti:TS5A9411
IC6 = mypots:DS1881
IC7 = linear:NE5534: LOW-NOISE OPERATIONAL AMPLIFIER Source: http://focus.ti.com/lit/ds/symlink/ne5534.pdf
IC8 = linear:TL074: OP AMP
IC9 = njr:NJM2762
IC12 = mypots:MAX5395; RESISTANCE: 10k
IC16 = myti:LM4880
IC17 = myti:LMV358?*: Dual General Purpose, Low Voltage, Rail-to-Rail Output Operational Amplifiers Source: http://www.national.com/mpf/LM/LMV321.html http://www.national.com/dt/lmv_qual.pdf
IC101 = schaltregler:LMR64010
IC3001 = myvreg:LM2676_SOIC
JP1 = pinhead:PINHD-2X11: PIN HEADER
L1-L4 = mylcr:L-EU
L101 L3001 = myinductors:L
Q1 = mycrystals:CRYSTAL_SHIELDED
R1-R33 R35-R82 R102 R103 = rcl:R-EU_: RESISTOR, European symbol
SV1 = con-harting-ml:ML6: HARTING
T2 = transistor:BC847: NPN TRANSISTOR
T3 = mytransistor:MMBTA92
T4 = mytransistor:BC847
T5 = myfets:IRLML5203
TP1 = testpad:TP: Test pad
X2 = con-neutrik_ag:NC3: Neutrik Audio Connector XLR SERIES Stereo 1/4" jack Source: www.neutrik.com/
X3 = con-neutrik_ag:NC5: Neutrik Audio Connector XLR SERIES Stereo 1/4" jack Source: www.neutrik.com/